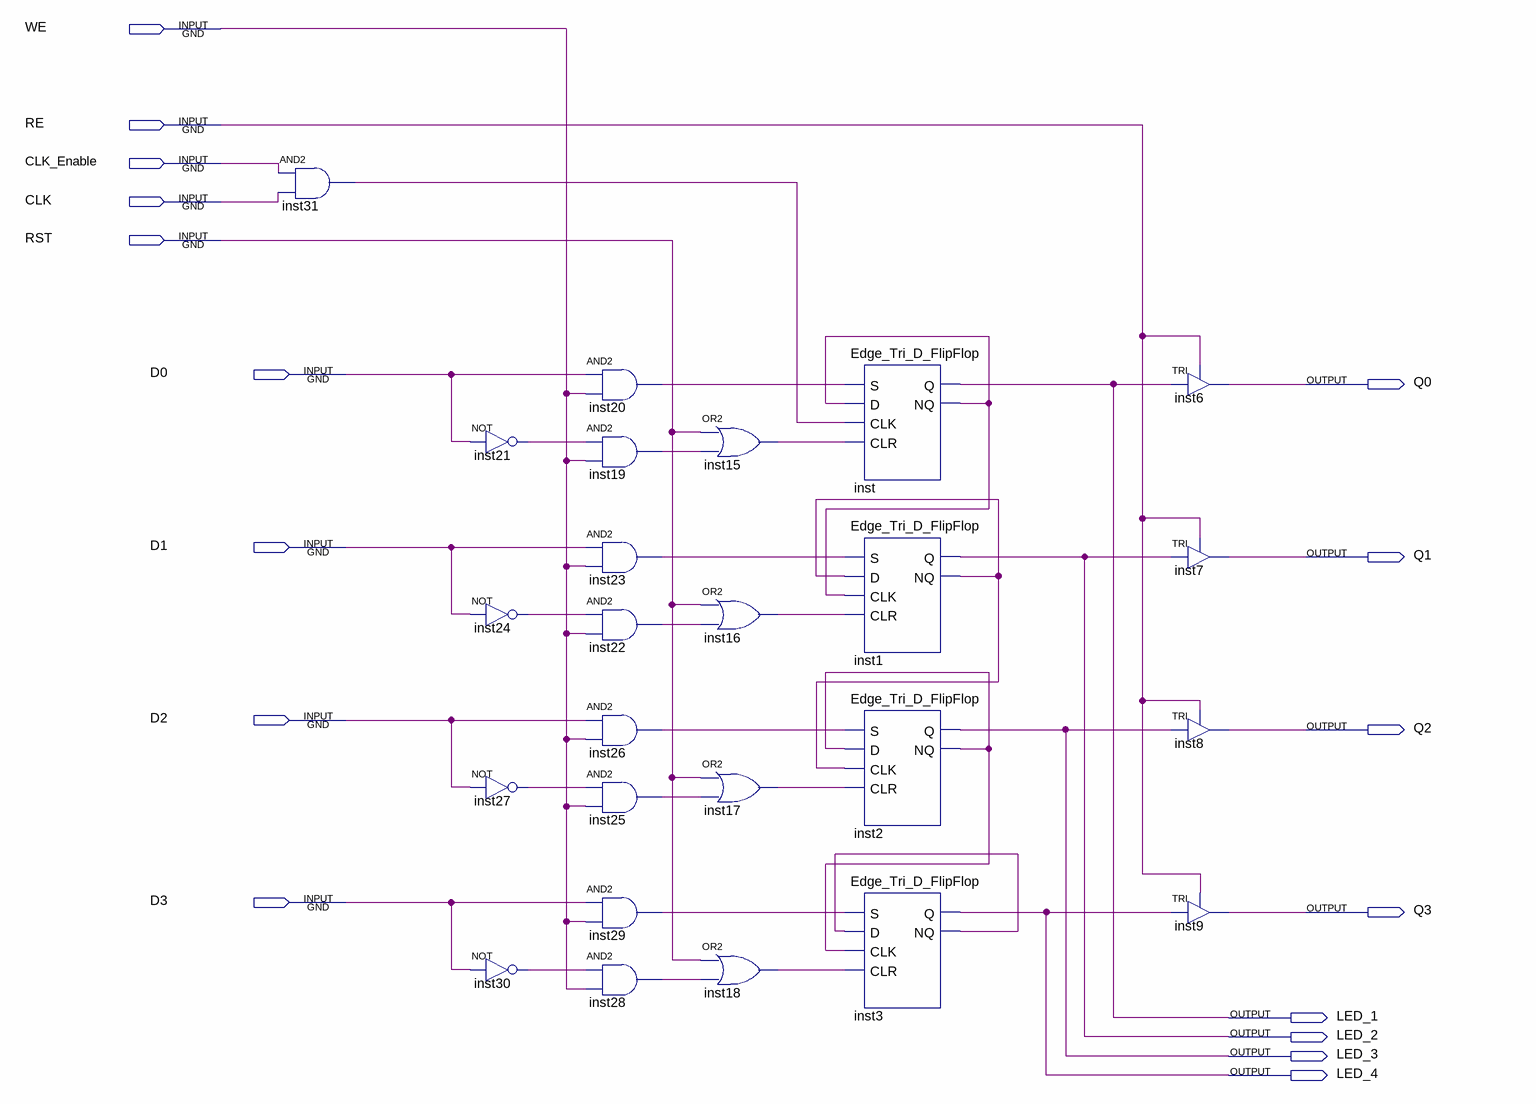
[diagram p0: schematic sheet]
// Quartus schematic ProgramCounter.bdf as structural Verilog: 25 symbols, 17 pins
module ProgramCounter (
  input  WE,
  input  RE,
  input  CLK_Enable,
  input  CLK,
  input  RST,
  input  D0,
  input  D1,
  input  D2,
  input  D3,
  output Q0,
  output Q1,
  output Q2,
  output Q3,
  output LED_1,
  output LED_2,
  output LED_3,
  output LED_4
);

  wire inst1_nq, inst2_nq, inst3_nq, inst15_out, inst16_out, inst17_out, inst18_out, inst19_out, inst20_out,
       inst21_out, inst22_out, inst23_out, inst24_out, inst25_out, inst26_out, inst27_out, inst28_out,
       inst29_out, inst30_out, inst31_out, inst_nq;

  and inst31 (inst31_out, CLK_Enable, CLK);
  not inst21 (inst21_out, D0);
  not inst24 (inst24_out, D1);
  not inst27 (inst27_out, D2);
  not inst30 (inst30_out, D3);
  and inst20 (inst20_out, D0, WE);
  and inst19 (inst19_out, inst21_out, WE);
  and inst23 (inst23_out, D1, WE);
  and inst22 (inst22_out, inst24_out, WE);
  and inst26 (inst26_out, D2, WE);
  and inst25 (inst25_out, inst27_out, WE);
  and inst29 (inst29_out, D3, WE);
  and inst28 (inst28_out, inst30_out, WE);
  or inst15 (inst15_out, RST, inst19_out);
  or inst16 (inst16_out, RST, inst22_out);
  or inst17 (inst17_out, RST, inst25_out);
  or inst18 (inst18_out, RST, inst28_out);
  Edge_Tri_D_FlipFlop inst (.S(inst20_out), .D(inst_nq), .CLK(inst31_out), .CLR(inst15_out), .Q(LED_1), .NQ(inst_nq));
  Edge_Tri_D_FlipFlop inst1 (.S(inst23_out), .D(inst1_nq), .CLK(inst_nq), .CLR(inst16_out), .Q(LED_2), .NQ(inst1_nq));
  Edge_Tri_D_FlipFlop inst2 (.S(inst26_out), .D(inst2_nq), .CLK(inst1_nq), .CLR(inst17_out), .Q(LED_3), .NQ(inst2_nq));
  Edge_Tri_D_FlipFlop inst3 (.S(inst29_out), .D(inst3_nq), .CLK(inst2_nq), .CLR(inst18_out), .Q(LED_4), .NQ(inst3_nq));
  TRI inst6 (.IN(LED_1), .OE(RE), .OUT(Q0));
  TRI inst7 (.IN(LED_2), .OE(RE), .OUT(Q1));
  TRI inst8 (.IN(LED_3), .OE(RE), .OUT(Q2));
  TRI inst9 (.IN(LED_4), .OE(RE), .OUT(Q3));
endmodule
